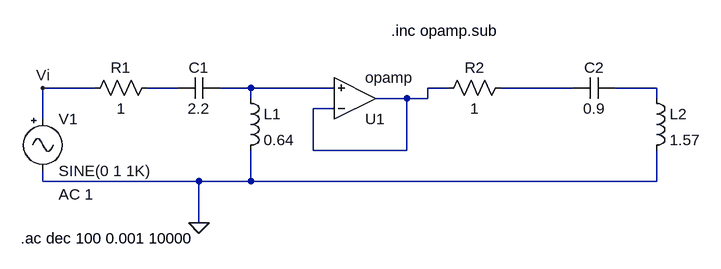
[diagram p0: schematic Circuito pasivo.asc]
Circuito pasivo.asc, the LTspice schematic file:
Version 4
SHEET 1 956 680
WIRE 16 128 -64 128
WIRE 144 128 96 128
WIRE 256 128 208 128
WIRE 384 128 256 128
WIRE 560 128 528 128
WIRE 752 128 640 128
WIRE 880 128 816 128
WIRE 256 144 256 128
WIRE 496 144 448 144
WIRE 528 144 528 128
WIRE 528 144 496 144
WIRE 880 144 880 128
WIRE 384 160 352 160
WIRE -64 176 -64 128
WIRE 352 224 352 160
WIRE 496 224 496 144
WIRE 496 224 352 224
WIRE -64 272 -64 256
WIRE 176 272 -64 272
WIRE 256 272 256 224
WIRE 256 272 176 272
WIRE 880 272 880 224
WIRE 880 272 256 272
WIRE 176 336 176 272
FLAG -64 128 Vi
FLAG 176 336 0
SYMBOL res 112 112 R90
WINDOW 0 0 56 VBottom 2
WINDOW 3 32 56 VTop 2
SYMATTR InstName R1
SYMATTR Value 1
SYMBOL cap 208 112 R90
WINDOW 0 0 32 VBottom 2
WINDOW 3 32 32 VTop 2
SYMATTR InstName C1
SYMATTR Value 2.2
SYMBOL ind 240 128 R0
SYMATTR InstName L1
SYMATTR Value 0.64
SYMBOL OpAmps\\opamp 416 208 M180
SYMATTR InstName U1
SYMBOL res 656 112 R90
WINDOW 0 0 56 VBottom 2
WINDOW 3 32 56 VTop 2
SYMATTR InstName R2
SYMATTR Value 1
SYMBOL cap 816 112 R90
WINDOW 0 0 32 VBottom 2
WINDOW 3 32 32 VTop 2
SYMATTR InstName C2
SYMATTR Value 0.9
SYMBOL ind 864 128 R0
SYMATTR InstName L2
SYMATTR Value 1.57
SYMBOL Misc\\signal -64 160 R0
WINDOW 123 24 132 Left 2
WINDOW 39 0 0 Left 0
SYMATTR InstName V1
SYMATTR Value2 AC 1
TEXT 472 40 Left 2 !.inc opamp.sub
TEXT -98 360 Left 2 !.ac dec 100 0.001 10000

The netlist it stands for:
* Circuito pasivo.asc
R1 N001 Vi 1
C1 N002 N001 2.2
L1 N002 0 0.64
XU1 N003 N002 N003 opamp Aol=100K GBW=10Meg  ; pins invin noninvin out
R2 N004 N003 1
C2 N005 N004 0.9
L2 N005 0 1.57
V1 Vi 0 SINE(0 1 1K) AC 1
.inc opamp.sub
.ac dec 100 0.001 10000
.backanno
.end